# EAGLE design Schematic (EAGLE 8.4.0)

## Sheet 1 of 2
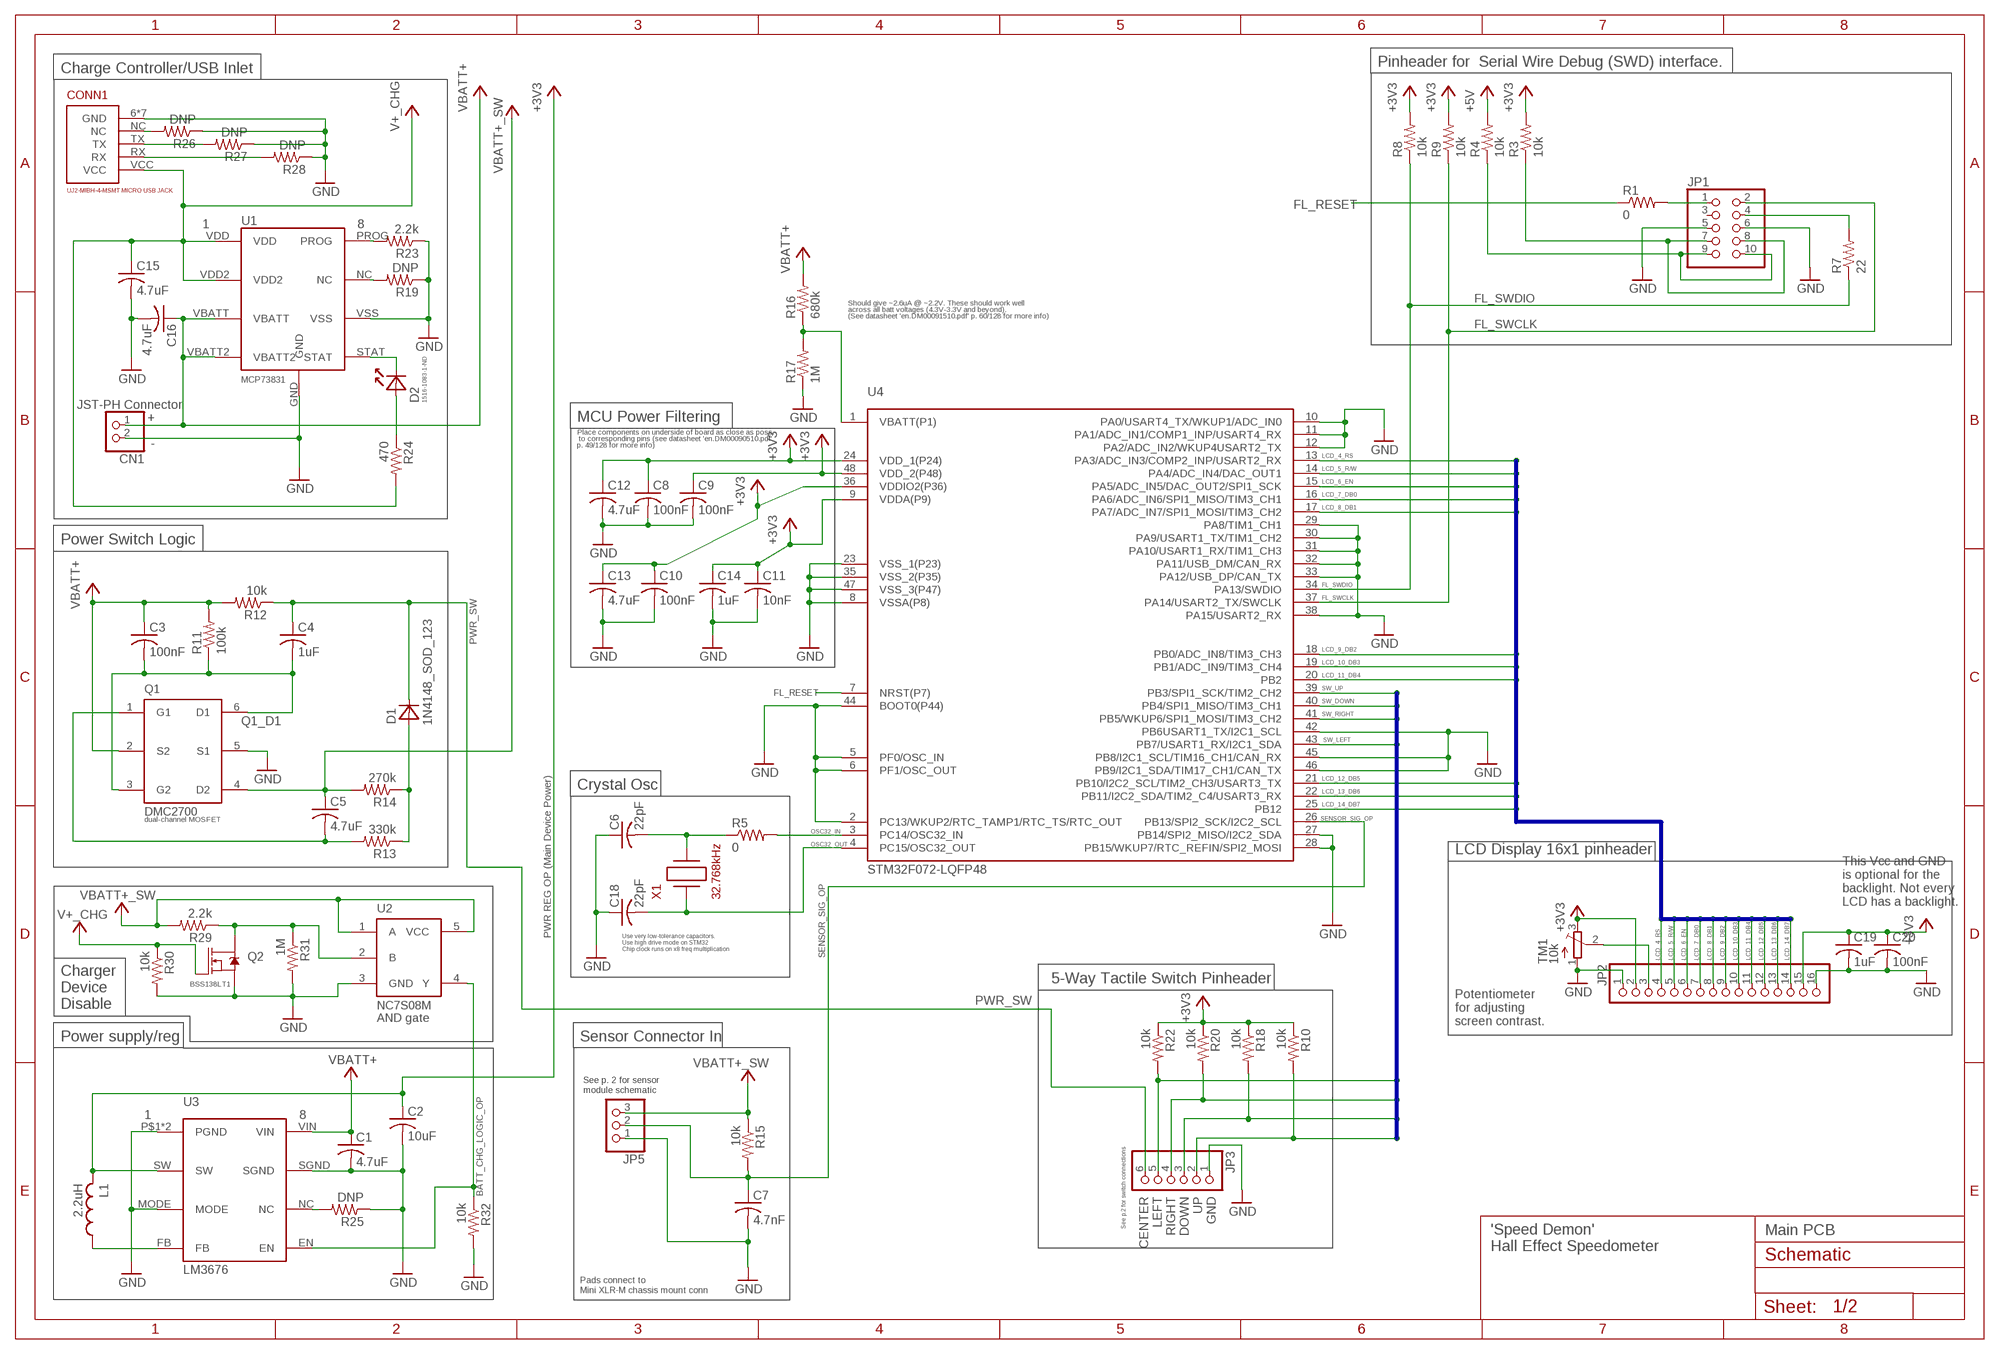
[diagram p0: schematic, sheet 1]

### Parts
C1  4.7uF  C_0805_NP  [C_0805]
C2  10uF  C_0805_NP  [C_0805]
C3  100nF  C_0805_NP  [C_0805]
C4  1uF  C_0805_NP  [C_0805]
C5  4.7uF  C_0805_NP  [C_0805]
C6  22pF  C_0805_NP  [C_0805]
C7  4.7nF  C_0805_NP  [C_0805]
C8  100nF  C_0805_NP  [C_0805]
C9  100nF  C_0805_NP  [C_0805]
C10  100nF  C_0805_NP  [C_0805]
C11  10nF  C_0805_NP  [C_0805]
C12  4.7uF  C_0805_NP  [C_0805]
C13  4.7uF  C_0805_NP  [C_0805]
C14  1uF  C_0805_NP  [C_0805]
C15  4.7uF  C_0805_NP  [C_0805]
C16  4.7uF  C_0805_NP  [C_0805]
C18  22pF  C_0805_NP  [C_0805]
C19  1uF  C_0805_NP  [C_0805]
C20  100nF  C_0805_NP  [C_0805]
CN1  JST_2PIN-SMT-RA  [JST-PH-2-SMT-RA]
CONN1  USB-MICRO-B  [UJ2-MIBH-4-MSMT-TR]
D1  1N4148_SOD_123  [D_SOD_123]
D2  LED_0805  [LED_0805]
JP1  PINHD-2X5  [2X05]
JP2  PINHD-1X16  [1X16]
JP3  PINHD-1X6  [1X06]
JP5  PINHD-1X3  [1X03]
L1  2.2uH  L_0805  [L_0805]
Q1  DMC2700  DMC2700_SOT-23-6  [SOT-23-6]
Q2  BSS138LT1_TO-236  [TO-236]
R1  0  R-US_R0805  [R0805]
R3  10k  R-US_R0805  [R0805]
R4  10k  R-US_R0805  [R0805]
R5  0  R-US_R0805  [R0805]
R7  22  R-US_R0805  [R0805]
R8  10k  R-US_R0805  [R0805]
R9  10k  R-US_R0805  [R0805]
R10  10k  R_0805  [R_0805]
R11  100k  R_0805  [R_0805]
R12  10k  R_0805  [R_0805]
R13  330k  R_0805  [R_0805]
R14  270k  R_0805  [R_0805]
R15  10k  R_0805  [R_0805]
R16  680k  R_0805  [R_0805]
R17  1M  R_0805  [R_0805]
R18  10k  R_0805  [R_0805]
R19  DNP  R_0805  [R_0805]
R20  10k  R_0805  [R_0805]
R22  10k  R_0805  [R_0805]
R23  2.2k  R_0805  [R_0805]
R24  470  R_0805  [R_0805]
R25  DNP  R_0805  [R_0805]
R26  DNP  R_0805  [R_0805]
R27  DNP  R_0805  [R_0805]
R28  DNP  R_0805  [R_0805]
R29  2.2k  R_0805  [R_0805]
R30  10k  R_0805  [R_0805]
R31  1M  R_0805  [R_0805]
R32  10k  R_0805  [R_0805]
TM1  10k  TRIMPOT3386  [TRIM-3386]
U1  MCP73831_8-DFN  [8-DFN-(2X3)]
U2  NC7S08_SOT_23_5  [SOT-23-5]
U3  LM3676  [WSON]
U4  STM32F072-LQFP48  [LQFP48]
X1  32.768kHz  XC2292CT-ND  [CRYSTAL_OSC_3.2X1.5]

### Nets
+3V3: C2.1 C8.1 C9.1 C10.1 C11.1 C12.1 C13.1 C14.1 C19.1 C20.1 JP2.2 JP2.15 L1.2 R3.2 R8.2 R9.2 R10.1 R18.1 R20.1 R22.1 TM1.3(E) U3.SW U4.9(VDDA(P9)) U4.24(VDD_1(P24)) U4.36(VDDIO2(P36)) U4.48(VDD_2(P48))
+5V: R4.2
+V+_CHG: C15.1 CONN1.VCC Q2.1(G) R24.2 R30.1 U1.VDD U1.VDD2 ; supply symbol labelled V+_CHG
BATT_CHG_LOGIC_OP: R32.1 U2.4(Y) U3.EN
FL_RESET: R1.1 U4.7(NRST(P7))
FL_SWCLK: JP1.2 R9.1 U4.37(PA14/USART2_TX/SWCLK)
FL_SWDIO: R7.1 R8.1 U4.34(PA13/SWDIO)
GND: C1.2 C2.2 C6.1 C7.2 C8.2 C9.2 C10.2 C11.2 C12.2 C13.2 C14.2 C15.2 C16.2 C18.1 C19.2 C20.2 CN1.2 CONN1.6(GND) CONN1.7(GND) CONN1.8(GND) CONN1.9(GND) CONN1.10(GND) CONN1.11(GND) CONN1.GND JP1.5 JP1.6 JP2.1 JP2.16 JP3.1 JP5.1 Q1.5(S1) Q2.2(S) R17.1 R19.1 R23.1 R25.1 R26.1 R27.1 R28.1 R30.2 R31.2 R32.2 TM1.1(A) U1.GND U1.VSS U2.3(GND) U3.MODE U3.P$1(PGND) U3.PGND U3.SGND U4.2(PC13/WKUP2/RTC_TAMP1/RTC_TS/RTC_OUT) U4.5(PF0/OSC_IN) U4.6(PF1/OSC_OUT) U4.8(VSSA(P8)) U4.10(PA0/USART4_TX/WKUP1/ADC_IN0) U4.11(PA1/ADC_IN1/COMP1_INP/USART4_RX) U4.12(PA2/ADC_IN2/WKUP4USART2_TX) U4.23(VSS_1(P23)) U4.27(PB14/SPI2_MISO/I2C2_SDA) U4.28(PB15/WKUP7/RTC_REFIN/SPI2_MOSI) U4.29(PA8/TIM1_CH1) U4.30(PA9/USART1_TX/TIM1_CH2) U4.31(PA10/USART1_RX/TIM1_CH3) U4.32(PA11/USB_DM/CAN_RX) U4.33(PA12/USB_DP/CAN_TX) U4.35(VSS_2(P35)) U4.38(PA15/USART2_RX) U4.42(PB6USART1_TX/I2C1_SCL) U4.44(BOOT0(P44)) U4.45(PB8/I2C1_SCL/TIM16_CH1/CAN_RX) U4.46(PB9/I2C1_SDA/TIM17_CH1/CAN_TX) U4.47(VSS_3(P47)) ; also sheet 2
LCD_4_RS: JP2.4 U4.13(PA3/ADC_IN3/COMP2_INP/USART2_RX)
LCD_5_R/W: JP2.5 U4.14(PA4/ADC_IN4/DAC_OUT1)
LCD_6_EN: JP2.6 U4.15(PA5/ADC_IN5/DAC_OUT2/SPI1_SCK)
LCD_7_DB0: JP2.7 U4.16(PA6/ADC_IN6/SPI1_MISO/TIM3_CH1)
LCD_8_DB1: JP2.8 U4.17(PA7/ADC_IN7/SPI1_MOSI/TIM3_CH2)
LCD_9_DB2: JP2.9 U4.18(PB0/ADC_IN8/TIM3_CH3)
LCD_10_DB3: JP2.10 U4.19(PB1/ADC_IN9/TIM3_CH4)
LCD_11_DB4: JP2.11 U4.20(PB2)
LCD_12_DB5: JP2.12 U4.21(PB10/I2C2_SCL/TIM2_CH3/USART3_TX)
LCD_13_DB6: JP2.13 U4.22(PB11/I2C2_SDA/TIM2_C4/USART3_RX)
LCD_14_DB7: JP2.14 U4.25(PB12)
N$1: C5.2 Q1.1(G1) R13.2
N$2: JP1.1 R1.2
N$3: JP1.9 JP1.10 R4.1
N$5: R5.2 U4.3(PC14/OSC32_IN)
N$6: JP1.7 JP1.8 R3.1
N$7: R16.1 R17.2 U4.1(VBATT(P1))
N$9: JP1.4 R7.2
N$10: L1.1 U3.FB
N$14: JP2.3 TM1.2(S)
N$15: D1.1(A) R13.1 R14.1
N$28: Q2.3(D) R29.1 R31.1 U2.2(B)
N$31: D2.2(C) U1.STAT
N$32: R19.2 U1.NC
N$33: D2.1(A) R24.1
N$34: R23.2 U1.PROG
N$35: R25.2 U3.NC
N$36: CONN1.NC R26.2
N$38: CONN1.TX R27.2
N$39: CONN1.RX R28.2
OSC32_IN: C6.2 R5.1 X1.P$1
OSC32_OUT: C18.2 U4.4(PC15/OSC32_OUT) X1.P$2
PWR_SW: C4.1 D1.2(C) JP3.6 R12.1
Q1_D1: C3.2 C4.2 Q1.3(G2) Q1.6(D1) R11.1
SENSOR_SIG_OP: C7.1 JP5.2 R15.2 U4.26(PB13/SPI2_SCK/I2C2_SCL)
SW_DOWN: JP3.3 R18.2 U4.40(PB4/SPI1_MISO/TIM3_CH1)
SW_LEFT: JP3.5 R22.2 U4.43(PB7/USART1_RX/I2C1_SDA)
SW_RIGHT: JP3.4 R20.2 U4.41(PB5/WKUP6/SPI1_MOSI/TIM3_CH2)
SW_UP: JP3.2 R10.2 U4.39(PB3/SPI1_SCK/TIM2_CH2)
VBATT+: C1.1 C3.1 C16.1 CN1.1 Q1.2(S2) R11.2 R12.2 R16.2 U1.VBATT U1.VBATT2 U3.VIN
VBATT+_SW: C5.1 JP5.3 Q1.4(D2) R14.2 R15.1 R29.2 U2.1(A) U2.5(VCC) ; also sheet 2
Unconnected: JP1.3

### Buses
LCD_4_RS,LCD_5_R/W,LCD_6_EN,LCD_7_DB0,LCD_8_DB1,LCD_9_DB2,LCD_10_DB3,LCD_11_DB4,LCD_12_DB5,LCD_13_DB6,LCD_14_DB7
SW_UP,SW_DOWN,SW_RIGHT,SW_LEFT

### Notes on the sheet
- Pinheader for  Serial Wire Debug (SWD) interface.
- Charge Controller/USB Inlet
- Should give ~2.6uA @ ~2.2V. These should work well
- across all batt voltages (4.3V-3.3V and beyond).
- (See datasheet 'en.DM00091510.pdf' p. 60/128 for more info)
- JST-PH Connector
- + | MCU Power Filtering
- Place components on underside of board as close as poss.
- to corresponding pins (see datasheet 'en.DM00090510.pdf'
- - | p. 49/128 for more info)
- Power Switch Logic
- Crystal Osc
- dual-channel MOSFET
- LCD Display 16x1 pinheader
- This Vcc and GND
  is optional for the
  backlight. Not every
  LCD has a backlight.
- PWR REG OP (Main Device Power) | Use very low-tolerance capacitors.
- Use high drive mode on STM32
- Chip clock runs on x8 freq multiplication
- 5-Way Tactile Switch Pinheader
- BSS138LT1
- Charger
  Device
  Disable
- Potentiometer
  for adjusting
  screen contrast.
- Power supply/reg | Sensor Connector In
- See p. 2 for sensor
  module schematic
- CENTER
  LEFT
  RIGHT
  DOWN
  UP
  GND
- See p.2 for switch connections
- Main PCB
- 'Speed Demon'
  Hall Effect Speedometer
- Pads connect to
  Mini XLR-M chassis mount conn

## Sheet 2 of 2
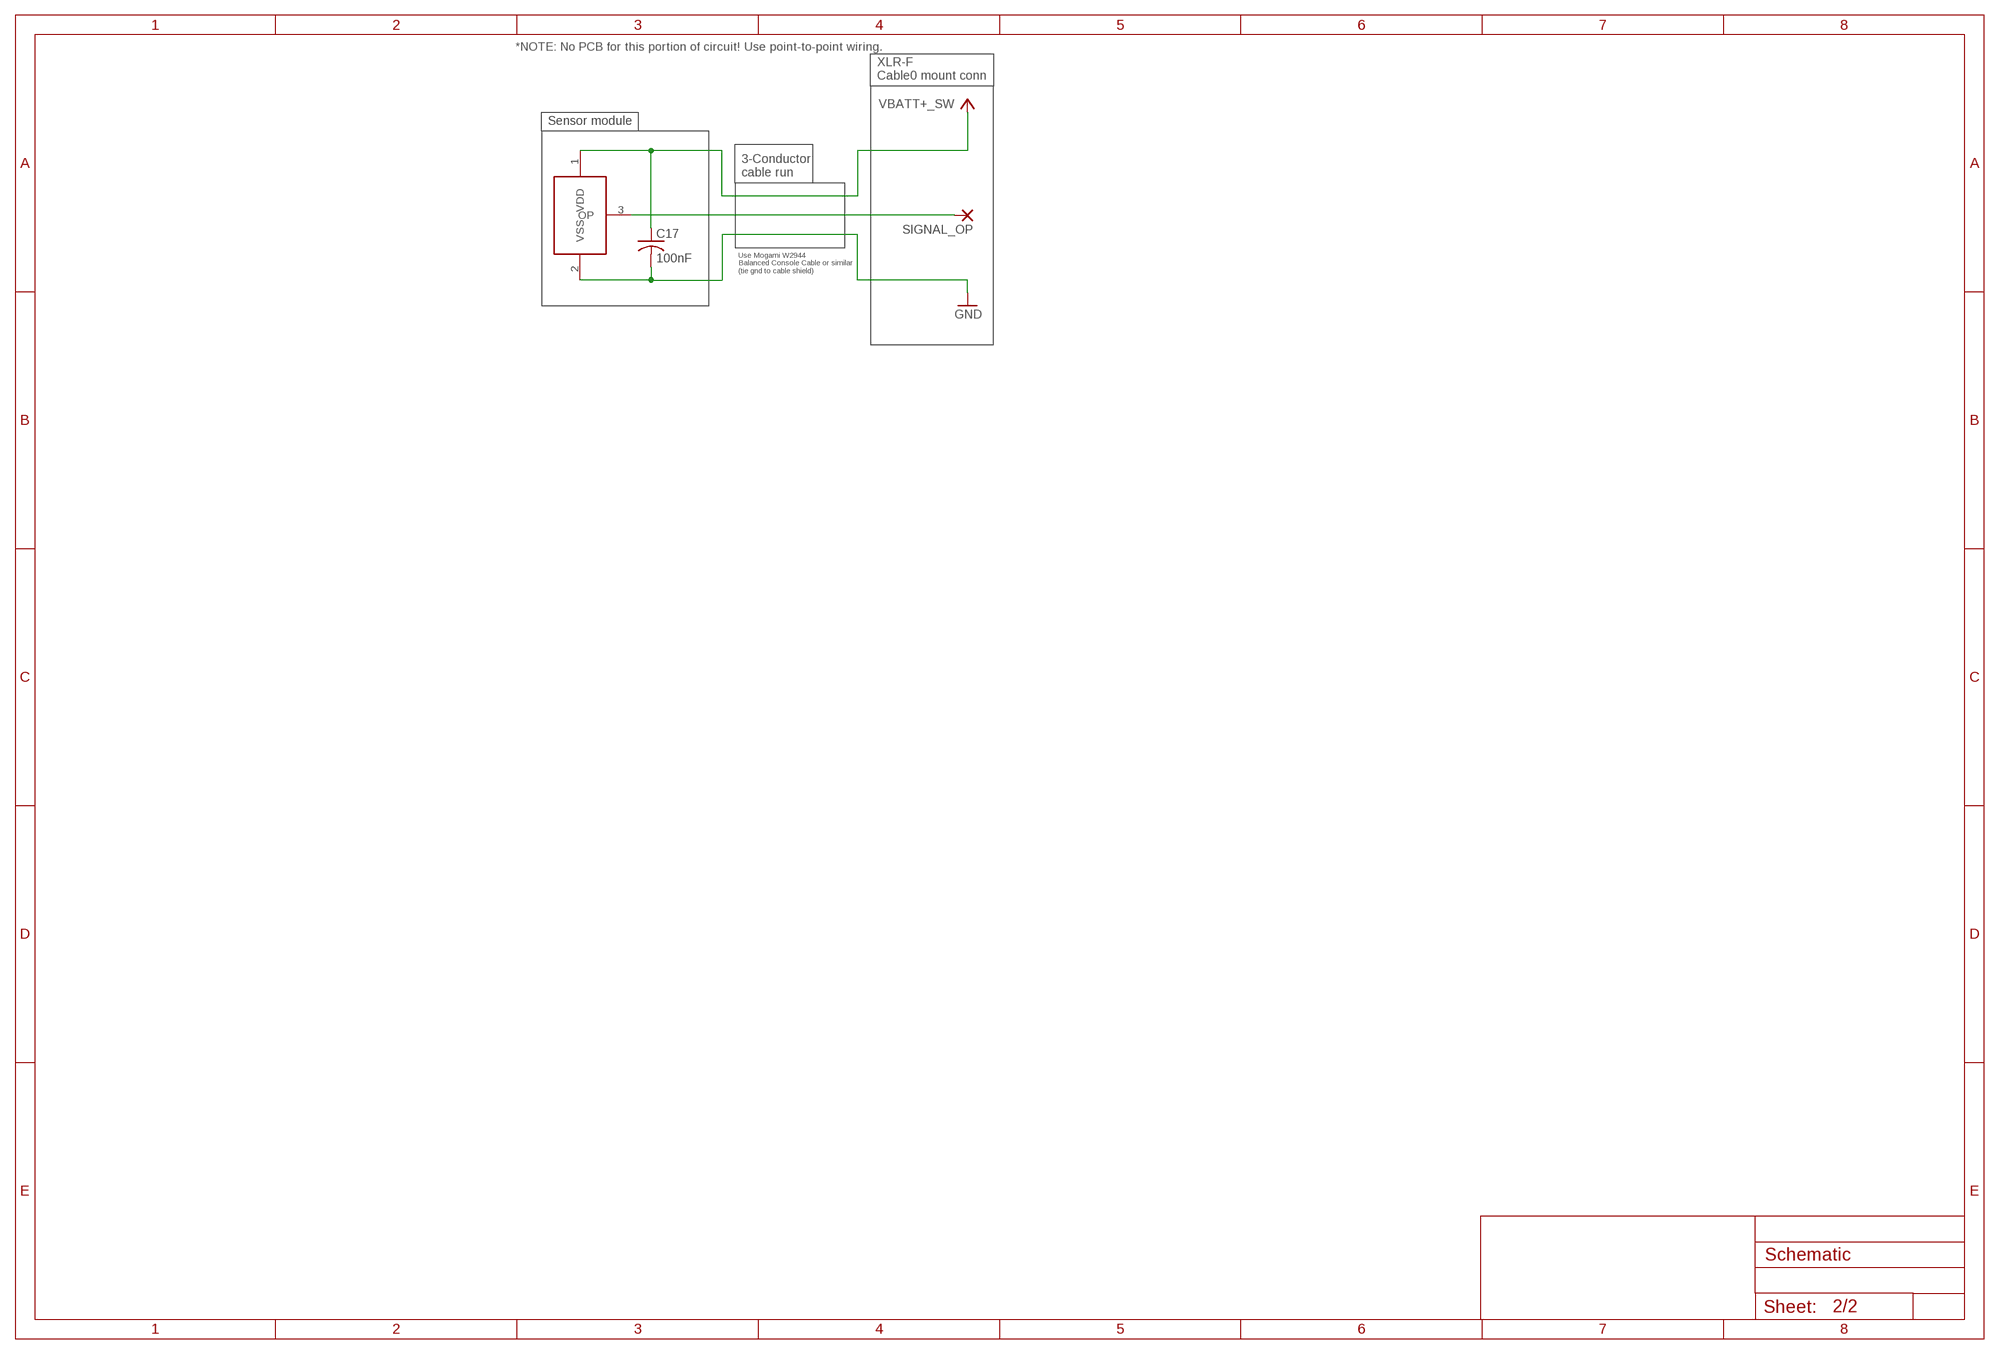
[diagram p1: schematic, sheet 2]

### Parts
C17  100nF  C-US025-024X044  [C025-024X044]
SIGNAL_OP  1,6/0,8  [1,6/0,8]
U1A  US5881  [TO-92]

### Nets
GND: C17.2 U1A.2(VSS) ; also sheet 1
N$37: SIGNAL_OP.1(P) U1A.3(OP)
VBATT+_SW: C17.1 U1A.1(VDD) ; also sheet 1

### Notes on the sheet
- *NOTE: No PCB for this portion of circuit! Use point-to-point wiring.
- XLR-F
  Cable0 mount conn
- Sensor module
- 3-Conductor
  cable run
- Use Mogami W2944
  Balanced Console Cable or similar
  (tie gnd to cable shield)

## Library data of the parts
C1-C5 C7-C16 C19 C20 = 0805_generics:C_0805_NP: generic capacitor in 0805 package
C6 C18 = LCRD_SMD_generics:C_0805_NP: generic capacitor in 0805 package
C17 = rcl:C-US: CAPACITOR, American symbol
CN1 = adafruit:JST_2PIN: JST 2-Pin Connectors of various flavors SMT-RA (S2B-PH-SM4) 4UConnector #17311 SMT (B2B-PH-SM4) THM-RA (S2B-PH) THM (B2B-PH)
CONN1 = USB_jack_102-4008-1-ND:USB-MICRO-B
D1 = LCRD_SMD_generics:1N4148_SOD_123
D2 = LCRD_SMD_generics:LED_0805
JP1 = pinhead:PINHD-2X5: PIN HEADER
JP2 = pinhead:PINHD-1X16: PIN HEADER
JP3 = pinhead:PINHD-1X6: PIN HEADER
JP5 = pinhead:PINHD-1X3: PIN HEADER
L1 = 0805_generics:L_0805: Inductor in 0805 package
Q1 = DMC2700:DMC2700_SOT-23-6
Q2 = DMC2700:BSS138LT1_TO-236
R1 R3-R5 R7-R9 = rcl:R-US_: RESISTOR, American symbol
R10-R20 R22-R32 = 0805_generics:R_0805
SIGNAL_OP = wirepad:1,6/0,8: THROUGH-HOLE PAD
TM1 = adafruit:TRIMPOT: SMT trimmer potentiometer part number TC33X http://www.ladyada.net/library/eagle
U1 = mcp73831:MCP73831_8-DFN
U1A = US5881:US5881: Hall effect sensor in TO-92 package
U2 = DMC2700:NC7S08_SOT_23_5
U3 = LM3676:LM3676: Switching Power Regulator. LM3676 Created by Nathaniel Dusciuc (10/20/2017) for ECE411.
U4 = stm32f0:STM32F072
X1 = LCRD_SMD_generics:XC2292CT-ND: 32.768KHz crystal oscillator with 5ppm tolerance (~.0005% error) Part name is Digi-key part #. Mfr. Part # is ECS-.327-CDX-1293 load capacitance = 12.5pF To determine ext capacitors use fmla: CL = [(CL1 * CL@)/(CL1+CL2)] + Cs where Cs is stray capacitance from PCB

## Board
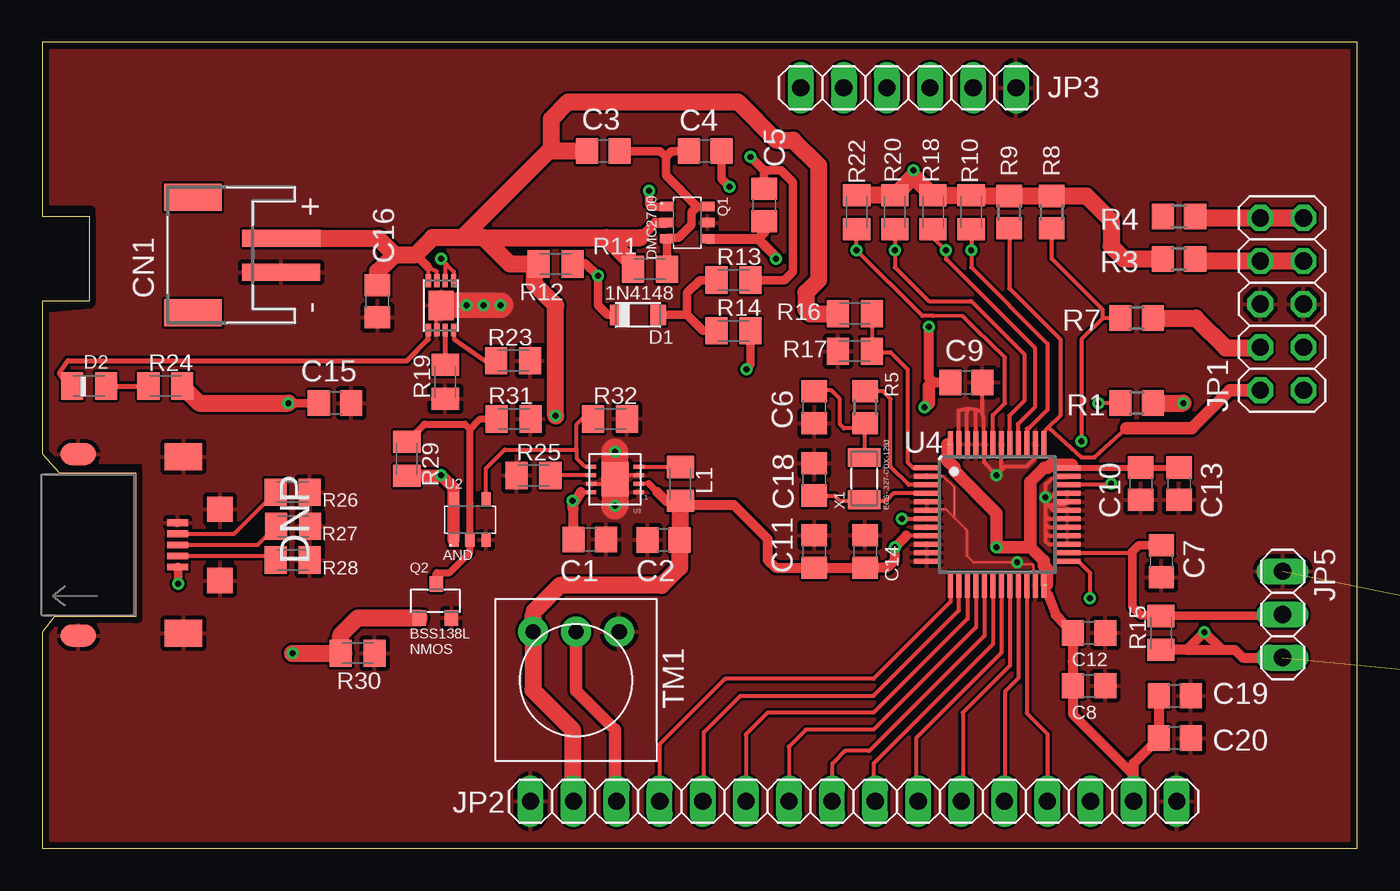
[diagram p2: board, top side]
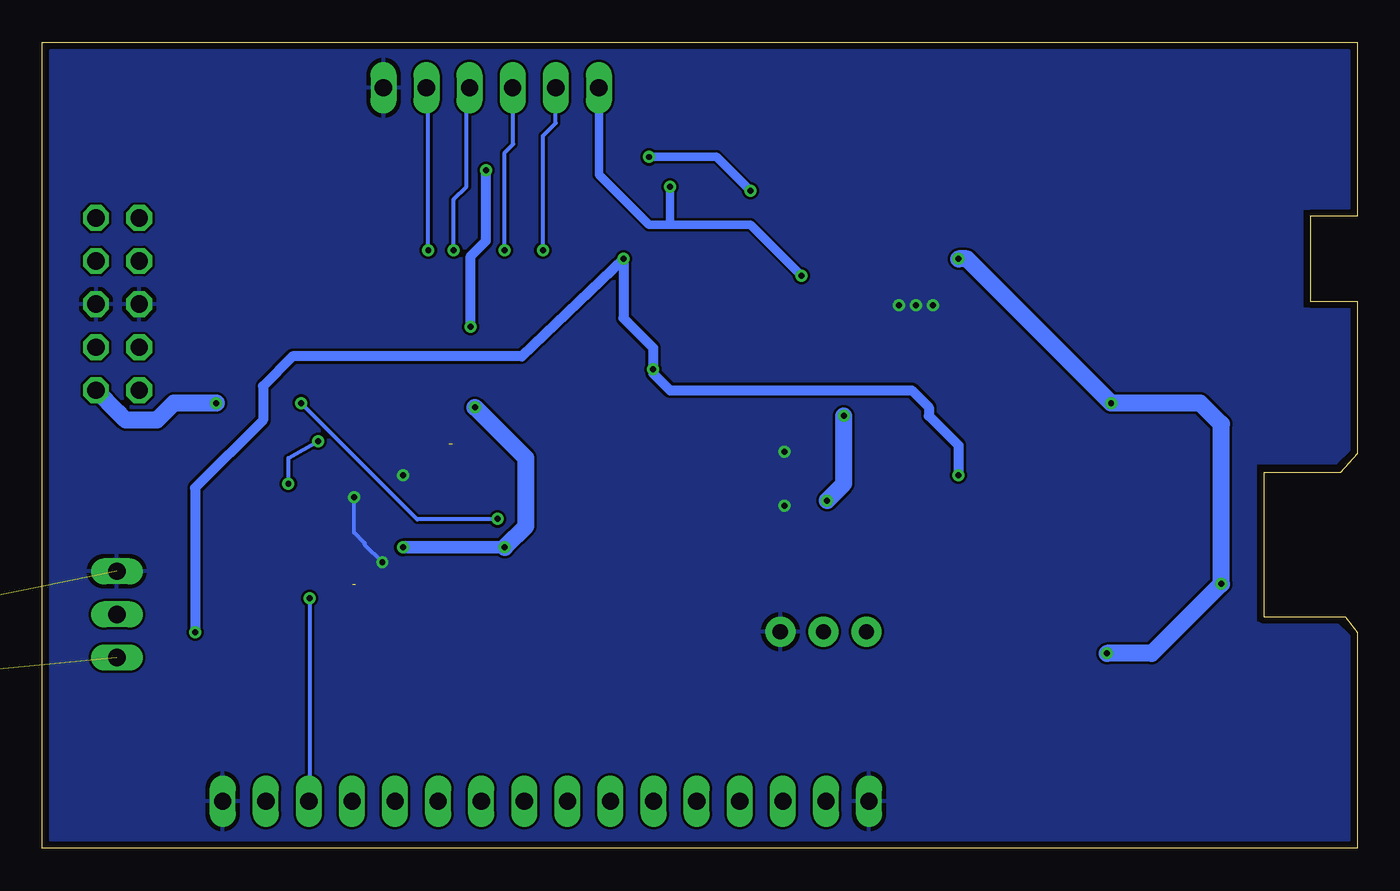
[diagram p3: board, bottom side, seen from below]

Size 77.5 x 47.5 mm. Coordinates in mm from the lower left corner, seen from the top.
Outline: 0,0 77.5,0 77.5,47.5 0,47.5 0,37.25 2.75,37.25 2.75,32.25 0,32.25 0,23.25 1,22.15 5.5,22.15 5.5,13.65 0.7,13.65 0,12.75 0,0
Copper layers (1*16): Top 0.0356mm / dielectric 1.5011mm / Bottom 0.0356mm
Design rules "LaenPCBOrder *": minimum track width 6mil, minimum drill 13mil, track to track 6mil, track to pad 6mil, pad to pad 6mil, via to via 6mil, smd to smd 6mil, copper to edge 15mil, drill to drill 6mil, minimum pad ring 7mil, minimum via ring 7mil, stop-mask expansion 3mil, vias tented up to drill 0mil, thermal gap 10mil

### Footprints (pad centres in the part's own frame; a part is rotated, then mirrored left to right if it is on the bottom)
C_0805 = smd 1.3 x 1.5: 1 -0.95,0; 2 0.95,0
C025-024X044 = drill 0.813 octagon: 1 -1.27,0; 2 1.27,0
JST-PH-2-SMT-RA = smd 1 x 4.6: 1 1,-3.7; 2 -1,-3.7 | smd 1.6 x 3.4: NC1 -3.4,1.5; NC2 3.4,1.5
UJ2-MIBH-4-MSMT-TR = smd 2.1 x 1.3: 6 0,5.35; 11 0,-5.35 | smd 2.2 x 1.6: 7 6.2,5.2; 10 6.2,-5.2 | smd 1.5 x 1.5: 8 8.35,2.1; 9 8.35,-2.1 | smd 1.25 x 0.4: GND 5.85,1.3; NC 5.85,0.65; RX 5.85,-0.65; TX 5.85,0; VCC 5.85,-1.3
D_SOD_123 = smd 0.914 x 1.219: 1 -1.181,0; 2 1.181,0
LED_0805 = smd 1.3 x 1.6: 1 -1,0; 2 1,0
2X05 = drill 1.016 octagon: 1 -5.08,-1.27; 2 -5.08,1.27; 3 -2.54,-1.27; 4 -2.54,1.27; 5 0,-1.27; 6 0,1.27; 7 2.54,-1.27; 8 2.54,1.27; 9 5.08,-1.27; 10 5.08,1.27
1X16 = drill 1.016 long: 1 -19.05,0; 2 -16.51,0; 3 -13.97,0; 4 -11.43,0; 5 -8.89,0; 6 -6.35,0; 7 -3.81,0; 8 -1.27,0; 9 1.27,0; 10 3.81,0; 11 6.35,0; 12 8.89,0; 13 11.43,0; 14 13.97,0; 15 16.51,0; 16 19.05,0
1X06 = drill 1.016 long: 1 -6.35,0; 2 -3.81,0; 3 -1.27,0; 4 1.27,0; 5 3.81,0; 6 6.35,0
1X03 = drill 1.016 long: 1 -2.54,0; 2 0,0; 3 2.54,0
L_0805 = smd 1.3 x 1.6: 1 -1,0; 2 1,0
SOT-23-6 = smd 0.55 x 0.8: 1 -0.95,-1.2; 2 0,-1.2; 3 0.95,-1.2; 4 0.95,1.2; 5 0,1.2; 6 -0.95,1.2
TO-236 = smd 0.8 x 0.9: 1 -0.95,-1; 2 0.95,-1; 3 0.05,1
R0805 = smd 1.3 x 1.5: 1 -0.95,0; 2 0.95,0
R_0805 = smd 1.3 x 1.6: 1 -1,0; 2 1,0
1,6/0,8 = drill 0.813 pad 1.6 octagon: 1 0,0
TRIM-3386 = drill 0.9 pad 1.778: 1 -2.54,-2.857; 2 0,-2.857; 3 2.54,-2.857
8-DFN-(2X3) = smd 1.45 x 1.75: GND 0,0 | smd 0.3 x 0.75: NC -0.25,1.45; PROG -0.75,1.45; STAT 0.75,1.45; VBATT 0.25,-1.45; VBATT2 0.75,-1.45; VDD -0.75,-1.45; VDD2 -0.25,-1.45; VSS 0.25,1.45
TO-92 = drill 0.813 pad 1.88: 1 -1.27,0; 2 0,1.905; 3 1.27,0
SOT-23-5 = smd 0.55 x 0.8: 1 -0.95,-1.2; 2 0,-1.2; 3 0.95,-1.2; 4 0.95,1.2; 5 -0.95,1.2
WSON = smd 0.6 x 0.25: EN 1.4,-0.75; FB -1.4,-0.75; MODE -1.4,-0.25; NC 1.4,-0.25; PGND -1.4,0.75; SGND 1.4,0.25; SW -1.4,0.25; VIN 1.4,0.75 | smd 1.6 x 2: P$1 0,0
LQFP48 = smd 1.5 x 0.3: 1 -4.15,2.75; 2 -4.15,2.25; 3 -4.15,1.75; 4 -4.15,1.25; 5 -4.15,0.75; 6 -4.15,0.25; 7 -4.15,-0.25; 8 -4.15,-0.75; 9 -4.15,-1.25; 10 -4.15,-1.75; 11 -4.15,-2.25; 12 -4.15,-2.75; 25 4.15,-2.75; 26 4.15,-2.25; 27 4.15,-1.75; 28 4.15,-1.25; 29 4.15,-0.75; 30 4.15,-0.25; 31 4.15,0.25; 32 4.15,0.75; 33 4.15,1.25; 34 4.15,1.75; 35 4.15,2.25; 36 4.15,2.75 | smd 0.3 x 1.5: 13 -2.75,-4.15; 14 -2.25,-4.15; 15 -1.75,-4.15; 16 -1.25,-4.15; 17 -0.75,-4.15; 18 -0.25,-4.15; 19 0.25,-4.15; 20 0.75,-4.15; 21 1.25,-4.15; 22 1.75,-4.15; 23 2.25,-4.15; 24 2.75,-4.15; 37 2.75,4.15; 38 2.25,4.15; 39 1.75,4.15; 40 1.25,4.15; 41 0.75,4.15; 42 0.25,4.15; 43 -0.25,4.15; 44 -0.75,4.15; 45 -1.25,4.15; 46 -1.75,4.15; 47 -2.25,4.15; 48 -2.75,4.15
CRYSTAL_OSC_3.2X1.5 = smd 1.1 x 1.9: P$1 1.25,0; P$2 -1.25,0

### Placement (x,y rotation side)
C1  32.27,18.21 0 top
C2  36.61,18.19 180 top
C3  33.06,41.09 0 top
C4  39.07,41.09 180 top
C5  42.54,37.92 90 top
C6  45.5,26 90 top
C7  65.96,16.93 270 top
C8  61.7,9.59 0 top
C9  54.47,27.46 0 top
C10  64.75,21.5 270 top
C11  45.5,17.5 90 top
C12  61.7,12.71 0 top
C13  67,21.5 270 top
C14  48.5,17.5 90 top
C15  17.25,26.25 0 top
C16  19.75,32.25 270 top
C17  117.24,7.09 0 top  (outside the outline)
C18  45.5,21.75 270 top
C19  66.75,9 0 top
C20  66.75,6.5 0 top
CN1  10.38,34.97 90 top
CONN1  2.12,17.89 0 top
D1  35.11,31.44 180 top
D2  2.75,27.25 180 top
JP1  73.07,32.08 90 top
JP2  47.82,2.78 0 top
JP3  51.05,44.83 180 top
JP5  73.11,13.79 270 top
L1  37.61,21.48 270 top
Q1  38.01,36.88 270 top
Q2  23.16,14.59 0 top
R1  64.5,26.25 0 top
R3  67,34.75 180 top
R4  67,37.25 180 top
R5  48.5,26 90 top
R7  64.5,31.25 0 top
R8  59.5,37.5 90 top
R9  57,37.5 90 top
R10  54.75,37.5 270 top
R11  35.81,34.14 180 top
R12  30.24,34.44 180 top
R13  40.75,33.5 0 top
R14  40.75,30.5 0 top
R15  65.94,12.7 90 top
R16  47.9,31.52 180 top
R17  47.89,29.31 0 top
R18  52.5,37.5 270 top
R19  23.75,27.5 90 top
R20  50.25,37.5 270 top
R22  48,37.5 270 top
R23  27.75,28.75 180 top
R24  7.25,27.25 0 top
R25  28.94,21.98 0 top
R26  14.75,21 180 top
R27  14.78,18.98 180 top
R28  14.75,17 180 top
R29  21.48,22.96 270 top
R30  18.59,11.51 0 top
R31  27.78,25.31 0 top
R32  33.47,25.31 0 top
SIGNAL_OP  123.14,1.12 0 top  (outside the outline)
TM1  31.46,9.92 180 top
U1  23.5,32 180 top
U1A  123.11,6.91 270 top  (outside the outline)
U2  25.2,19.38 0 top
U3  33.75,21.75 180 top
U4  56.28,19.68 0 top
X1  48.45,21.8 90 top

### Tracks (layer width: path | path; a pad name or v marks a point on that pad's centre or on a via)
+3V3  (via drill 0.35)  (2 unrouted)
  Top 0.203: U4.24 59,15.5
  Top 0.25: U4.9 50.93,18.43 | U4.24 59.28,14.97 | 59.06,22.43 59.25,22.43 U4.36 | 64.73,22.43 C10.1 | 64.33,4.32 JP2.15 | L1.2 37.84,20.25 | 35.75,21.5 U3.SW | 37.61,18.24 C2.1 | 29,14 29,13.75 28.92,13.67 | 31.25,2.84 JP2.2
  Top 0.35: U4.36 64.73,22.43 | C10.1 C13.1
  Top 0.4: 35.75,21.5 36.25,21
  Top 0.5: 52.25,27.25 52.53,27.46 | v51.35,39.96 51.35,39.6 | 52.46,38.5 R18.1 | R10.1 54.8,38.45
  Top 0.6: 50.93,18.43 v50.25,17.75 50.25,17 49.8,16.55 C14.1 C11.1 43.2,16.55 42.75,17 42.75,18.25 40.75,20.25 37.84,20.25 | 59.28,14.97 59.73,13.77 C12.1 60.74,11.03 C8.1 60.75,7.92 64.33,4.32 | C9.1 52.53,27.46 52.25,27.74 v52.25,30.75 | JP2.15 64.33,5.03 C20.1 C19.1 | L1.2 36.77,20.48 36.25,21
  Top 0.75: v52,26 52.25,26.25 52.25,27.25 | 58.25,17.75 v56.25,17.75 56.25,19.75 53.75,22.25 53.75,22.46 53.35,22.86 53.35,23.83 | 58.25,17.75 58.25,21.63 59.06,22.43 | 59.21,15.53 59.21,16.5 59.03,16.68 59.03,16.97 58.25,17.75 | 60.68,22.61 59.46,22.61 59.29,22.43 59.25,22.43
  Top 1: 37.61,18.24 L1.2 | C2.1 37.56,16.56 36.5,15.5 30.5,15.5 29,14 | 28.92,13.67 TM1.3 28.92,9.33 31.25,7 31.25,2.84 | 52.46,38.5 51.35,39.6 R20.1 R22.1 | R18.1 R10.1 | 54.8,38.45 R9.2 R8.2 61.55,38.45 63,37 63,35.5 63.75,34.75 R3.2
  Bottom 0.25: 52.25,34.91 52.26,34.92
  Bottom 0.5: v51.35,39.96 51.35,39.74 51.37,39.73
  Bottom 0.6: v52.25,30.75 52.25,34.91 51.37,35.8 51.37,39.73
  Bottom 0.75: v50.25,17.75 v56.25,17.75
  Bottom 1: v50.25,17.75 49,19 49,23 v52,26
+V+_CHG  (via drill 0.35)
  Top 0.25: U1.VDD2 23.75,34.5 v23.5,34.75 24.25,34 U1.VDD
  Top 0.3: 17.78,11.5 R30.1
  Top 0.5: v8,15.6 8.01,16.09 CONN1.VCC | v14.5,26.25 C15.1
  Top 1: v14.75,11.5 17.78,11.5 | R24.2 9.25,26.25 v14.5,26.25 | R30.1 17.59,12.59 18.59,13.59 Q2.1
  Bottom 1: v14.75,11.5 12.1,11.5 v8,15.6 8,25 9.25,26.25 v14.5,26.25 23,34.75 v23.5,34.75
BATT_CHG_LOGIC_OP
  Top 0.25: U3.EN 32,22.5 31.5,23 31.5,23.5 | 31.5,23.5 31.5,25 31.81,25.31 R32.1 | U2.4 26.15,22.4 27.25,23.5 31.5,23.5
FL_RESET  (via drill 0.35)
  Top 0.25: R1.1 v62.25,26.25 | v50.67,19.42 v50.68,19.43 U4.7
  Bottom 0.152: v50.67,19.42 v50.66,19.42 50.64,19.4
  Bottom 0.25: v62.25,26.25 55.4,19.4 50.64,19.4
FL_SWCLK
  Top 0.25: 59.25,24.75 60,25.5 60,30 57,33 R9.1 | 59.25,24.75 59,24.5 59,23.86 U4.37 | 59.25,24.75 59.36,24.75 61.25,23.04 62.02,23.04 63.89,24.75
  Top 0.75: 63.89,24.75 67.75,24.75 70,27 JP1.2
FL_SWDIO  (via drill 0.35)
  Top 0.25: R7.1 62.5,31.25 | 62.5,31.25 61.25,30 v61.25,24 | v63,21.5 62.68,21.43 U4.34 | 62.5,31.25 62.5,31.75 59.5,34.75 R8.1
  Bottom 0.25: v61.25,24 63,23 v63,21.5
GND  (via drill 0.35)  (2 unrouted)
  Top 0.152: U4.23 58.53,16.22 58.5,16.25 58.5,16.35 58.43,16.43 58.43,16.72 58.4,16.75 57.57,16.75 v57.46,16.86 54.89,16.86 54.5,17.25 54.5,18.75 53.75,19.5 | 53.75,19.5 53.25,20 52.2,20 U4.6 | U4.2 53.09,21.94 53.75,21.27 53.75,19.5 | 59.48,21.77 59.55,21.77 59.59,21.81 60.31,21.81 U4.35
  Top 0.25: U3.SGND 33,21.5 33.25,21.75 U3.P$1 | U3.MODE 34.5,22 34.25,21.75 U3.P$1 | U3.P$1 33.75,22.62 | U1.VSS 23.25,31.5 23.5,31.75 U1.GND | v59.13,20.71 59.13,21.42 59.48,21.77 | 54.6,25.9 54,25.8 54,25.25 U4.47 | 55.03,25.86 54.6,25.9 | 55.42,25.72 55.03,25.86 | 55.42,25.72 C9.2 | U4.46 54.53,24.33 54.5,24.36 54.5,25.75 54.6,25.9 | U4.45 55.03,24.72 55.03,25.86 | 55.42,25.72 55.5,25.28 55.5,24.5 55.53,24.47 U4.44 55.53,22.72 v56.25,22 | U4.42 56.53,22.28 v56.25,22 | U4.38 58.53,23.03 58,22.5 56.75,22.5 v56.25,22 | v59.13,20.71 59.47,20.71 59.69,20.93 U4.33 | v59.13,20.71 59.13,20.37 | U4.31 59.57,19.93 59.57,19.94 59.56,19.94 59.25,20.25 | 59.13,20.37 59.25,20.25 | 59.25,20.25 60.25,20.25 U4.32 | 59.13,20.37 59.13,19.62 | U4.30 59.32,19.43 59.13,19.62 | 59.13,19.62 59.13,19.12 | U4.29 59.32,18.93 59.13,19.12 | 59.13,19.12 59.13,18.62 | U4.28 59.32,18.43 59.13,18.62 | 59.13,18.62 59.13,18.12 59.32,17.93 U4.27
  Top 1.5: U1.GND v25,32 v26,32 v27,32
  Top 1.6: v33.75,23.38 U3.P$1 v33.75,20.19
  Bottom 0.25: v57.46,16.86 58.5,17.9 58.5,18 59.13,18.63 v59.13,20.71
  pour Bottom: 0.5,0.5 0.5,12.5 1.25,13.25 6,13.25 6,22.75 1.25,22.75 0.5,23.5 0.5,31.75 3.25,31.75 3.25,37.75 0.5,37.75 0.5,47 77,47 77,0.5
  pour Top: 0.5,23.5 0.5,31.5 3,31.75 3.25,32 3.25,37.75 3,38 0.5,38 0.5,47 77,47 77,0.5 0.5,0.5 0.5,13 0.75,13.25 6,13.25 6,22.75 1.25,22.75
LCD_4_RS
  Top 0.25: U4.13 53.53,14.53 49,10 40.25,10 36.39,6.14 JP2.4
LCD_5_R/W
  Top 0.25: JP2.5 39,2.85 39,6.86 41.15,9 49,9 54.03,14.03 U4.14
LCD_6_EN
  Top 0.25: U4.15 54.53,13.53 49,8 42.75,8 41.47,6.72 JP2.6
LCD_7_DB0
  Top 0.25: U4.16 55.03,13.03 49,7 45,7 44,6 JP2.7
LCD_8_DB1
  Top 0.25: U4.17 55.53,12.53 48.75,5.75 47.31,5.75 46.56,5 46.55,4.95 JP2.8
LCD_9_DB2
  Top 0.25: U4.18 56.03,12.03 49,5 49,2.87 JP2.9
LCD_10_DB3
  Top 0.25: U4.19 56.53,11.53 51.5,6.5 51.5,2.91 JP2.10
LCD_11_DB4
  Top 0.25: U4.20 57.03,10.78 54.25,8 54.25,2.86 JP2.11
LCD_12_DB5
  Top 0.25: U4.21 57.53,10.03 56.75,9.25 56.75,2.82 JP2.12
LCD_13_DB6
  Top 0.25: U4.22 58.03,7.97 59.25,6.75 JP2.13
LCD_14_DB7  (via drill 0.35)
  Top 0.25: U4.25 61.07,16.93 61.75,16.25 v61.75,14.75
  Bottom 0.25: v61.75,14.75 61.75,2.82 JP2.14
N$1  (via drill 0.35)
  Top 0.5: Q1.1 35.92,37.83 35.75,38 v35.75,38.75 | C5.2 42.54,39.96 | v41.75,40.75 42.54,39.96 | 42.54,39.96 43.54,39.96 44.25,39.25 44.25,34 43.73,33.48 R13.2
  Bottom 0.5: v35.75,38.75 37.75,40.75 v41.75,40.75
N$2  (via drill 0.35)
  Top 1: R1.2 v67.25,26.25
  Bottom 1: v67.25,26.25 69.75,26.25 70.75,25.25 72.58,25.25 73,25.66 JP1.1
N$3
  Top 0.25: R4.1 68.04,37.16
  Top 1: 68.04,37.16 JP1.10 JP1.9
N$5
  Top 0.25: U4.3 51.07,21.43 50,22.5 50,26.5 49.55,26.95 R5.2
N$6
  Top 0.25: R3.1 68.08,34.62
  Top 1: 68.08,34.62 JP1.8 JP1.7
N$7
  Top 0.2: R17.2
  Top 0.25: R17.2 48.95,29.25 50,29.25 51,28.25 51,22.75 51.32,22.43 U4.1 | R16.1 R17.2
N$9
  Top 0.25: 71.76,29.5 JP1.4
  Top 1: R7.2 68,31.25 69.75,29.5 71.76,29.5
N$10
  Top 0.25: L1.1 37.52,22.39 37.41,22.5 U3.FB
N$14
  Top 0.25: 33.75,2.88 JP2.3
  Top 0.75: TM1.2 31.46,9.29 33.75,7 33.75,2.88
N$15
  Top 0.5: R13.1 38.75,33.5 38,32.75 37.99,31.44 | 37.99,31.44 38.93,30.5 R14.1 | D1.1 37.99,31.44
N$28
  Top 0.25: 23.21,16.21 23.25,16.25
  Top 0.4: 25.2,24.7 U2.2 25.2,17.45 24,16.25 23.25,16.25 | R31.1 25.81,25.31 25.2,24.7 | R29.1 22.52,25 24.9,25 25.2,24.7 | Q2.3 23.21,16.21
N$31
  Top 0.2: D2.2 1.5,27.5 1.5,27.25
  Top 0.305: 1.5,27.25 1,28 1.5,28.75 21.5,28.75 22.75,30 U1.STAT
N$32
  Top 0.305: U1.NC R19.2
N$33
  Top 0.305: D2.1 R24.1
N$34
  Top 0.25: U1.PROG 24.27,30.02
  Top 0.305: R23.2 26.05,28.76 24.27,30.02
N$35
  Top 0.25: U3.NC 30.46,22 R25.2
N$36
  Top 0.25: CONN1.NC 11.29,18.54 R26.2
N$37  (1 unrouted)
N$38
  Top 0.25: CONN1.TX 12.69,17.89 R27.2
N$39
  Top 0.25: CONN1.RX 11.74,17.24 | 11.74,17.24 11.75,17.25 | 11.74,17.24 13.51,17.24 R28.2
OSC32_IN
  Top 0.25: X1.P$1 48.45,25 R5.1 48.2,24.75 47.25,24.75 47,25 47,26.5 46.5,27 45.55,27 C6.2
OSC32_OUT
  Top 0.25: U4.4 50.18,20.93 49.75,20.5 48.5,20.5 | 48.5,20.5 X1.P$2 | C18.2 46.7,20.8 47,20.5 48.5,20.5
PWR_SW  (via drill 0.35)
  Top 0.5: D1.2 33.31,31.44 32.75,32 v32.75,33.75 32,34.5 31.94,34.44 R12.1 | v40.5,39 40.02,39.48 C4.1
  Bottom 0.5: v32.75,33.75 35.75,36.75 40.5,36.75 | 40.5,36.75 41.75,36.75 44.7,39.7 JP3.6 | v40.5,39 40.5,36.75
Q1_D1
  Top 0.4: 36.88,36 Q1.3
  Top 0.5: 36.88,36 37.5,36 38.25,36.75 38.25,37.5 38.58,37.83 | Q1.6 38.58,37.83 | 38.58,37.83 36.75,39.66 36.75,40.75 | 36.75,40.75 37.09,41.09 C4.2 | 36.75,40.75 36.41,41.09 C3.2 | Q1.3 R11.1
SENSOR_SIG_OP
  Top 0.25: U4.26 64.18,17.43
  Top 0.5: JP5.2 73.02,13.7 R15.2 65.89,13.75 64.75,13.75 64.25,14.25 64.25,17.5 | C7.1 64.63,17.88 64.25,17.5 | 64.18,17.43 64.25,17.5
SW_DOWN  (via drill 0.35)
  Top 0.25: R18.2 52.5,36 v53.25,35.25 53.25,34.75 58.5,29.5 58.5,26 57.5,25 57.5,23.86 U4.40
  Bottom 0.25: v53.25,35.25 53.25,38.25 52.5,39 52.5,44.65 JP3.3
SW_LEFT  (via drill 0.35)
  Top 0.25: U4.43 56.03,25.53 56.75,26.25 56.75,28.94 55.02,30.6 55.1,30.53 54.25,31.36 52.51,31.38 51.87,31.38 v48,35.25 R22.2
  Bottom 0.25: v48,35.25 48,42 47.25,42.75 JP3.5
SW_RIGHT  (via drill 0.35)
  Top 0.25: R20.2 v50.25,35.25 50.25,34.25 52.25,32.25 54.75,32.25 57.89,29.11 57.89,26.39 57,25.5 57,23.86 U4.41
  Bottom 0.25: v50.25,35.25 50.25,41 49.75,41.5 49.75,44.8 JP3.4
SW_UP  (via drill 0.35)
  Top 0.25: R10.2 v54.75,35.25 54.75,34.25 59.25,29.75 59.25,25.84 58.16,24.75 58.14,24.77 58.03,24.72 U4.39
  Bottom 0.25: v54.75,35.25 54.75,44.72 JP3.2
VBATT+  (via drill 0.35)
  Top 0.25: U1.VBATT2 22.75,34.25 23.25,34.01 U1.VBATT | 31.75,21 U3.VIN
  Top 0.5: 22,35 22.75,34.25 | 46.88,31.5 R16.2
  Top 0.6: Q1.2 36.14,36.88 35.25,36 | C1.1 31.32,20 | 31.32,20 31.32,20.32 31.75,21 | 30.16,41.09 30,41.25 | 31.32,20 31.25,20.07 v31.25,20.5
  Top 1: CN1.1 19.79,35.97 20.75,35 | 20.75,35 22,35 23,36 24.75,36 | 20.75,35 19.75,34 C16.1 | 29,34.44 27.56,34.44 26,36 | 29,34.44 R12.2 | 26,36 24.75,36 | 26,36 33.25,36 | 33.25,36 35.25,36 | 24.75,36 30,41.25 30,43 31,44 41,44 43.25,41.75 44.25,41.75 45.75,40.25 45.75,33.5 45,32.75 45,31.75 45.25,31.5 46.88,31.5 | C3.1 30.16,41.09 | v30.25,25.5 30.25,32 29,33.25 29,34.44 | 33.25,36 34.81,34.44 R11.2
  Bottom 1: v31.25,20.5 30.25,21.5 v30.25,25.5
VBATT+_SW  (via drill 0.35)  (2 unrouted)
  Top 0.25: 43.25,34.86 v43.25,34.75 | 67.5,11.75 67.5,11.7 | 23.46,21.96 v23.5,22
  Top 0.5: v41.5,28.25 41.75,28.5 R14.2
  Top 0.6: Q1.4 42.18,35.93 | C5.1 42.54,36.29 42.18,35.93 | 42.18,35.93 43.25,34.86 | 69.56,11.7 v68.5,12.75 67.5,11.75 | R15.1 67.5,11.7 69.56,11.7 | 69.56,11.7 70.3,11.7 70.75,11.25 JP5.3
  Top 0.75: U2.1 U2.5 24.25,21.25 v23.5,22 | R29.2 23.46,21.96
  Bottom 0.6: v68.5,12.75 68.5,21.25 64.5,25.25 64.5,27.25 62.75,29 49.25,29 v43.25,34.75 43.25,31.25 41.5,29.5 v41.5,28.25 41.5,28 40.5,27 26.25,27 25.25,26 25.25,25.5 23.5,23.75 v23.5,22

### Text on the board
tPlace: DNP